# Altium schematic sheet MID.SchDoc
size A
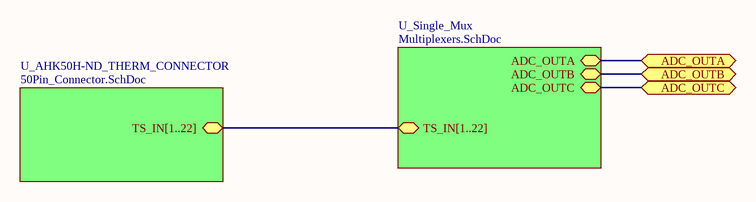
[diagram p0: MID.SchDoc]

## Sub-sheets
U_AHK50H-ND_THERM_CONNECTOR = 50Pin_Connector.SchDoc: TS_IN[1..22]
U_Single_Mux = Multiplexers.SchDoc: ADC_OUTA (bidir), TS_IN[1..22], ADC_OUTB (bidir), ADC_OUTC (bidir)

## Ports
ADC_OUTA (bidir), ADC_OUTB (bidir), ADC_OUTC (bidir)

## Nets
ADC_OUTA: port ADC_OUTA, sheet U_Single_Mux/ADC_OUTA
ADC_OUTB: port ADC_OUTB, sheet U_Single_Mux/ADC_OUTB
ADC_OUTC: port ADC_OUTC, sheet U_Single_Mux/ADC_OUTC

## Buses and harness runs
bus sheet U_AHK50H-ND_THERM_CONNECTOR/TS_IN[1..22] = sheet U_Single_Mux/TS_IN[1..22]